# Altium schematic sheet CAN_Transceiver.SchDoc
size A4
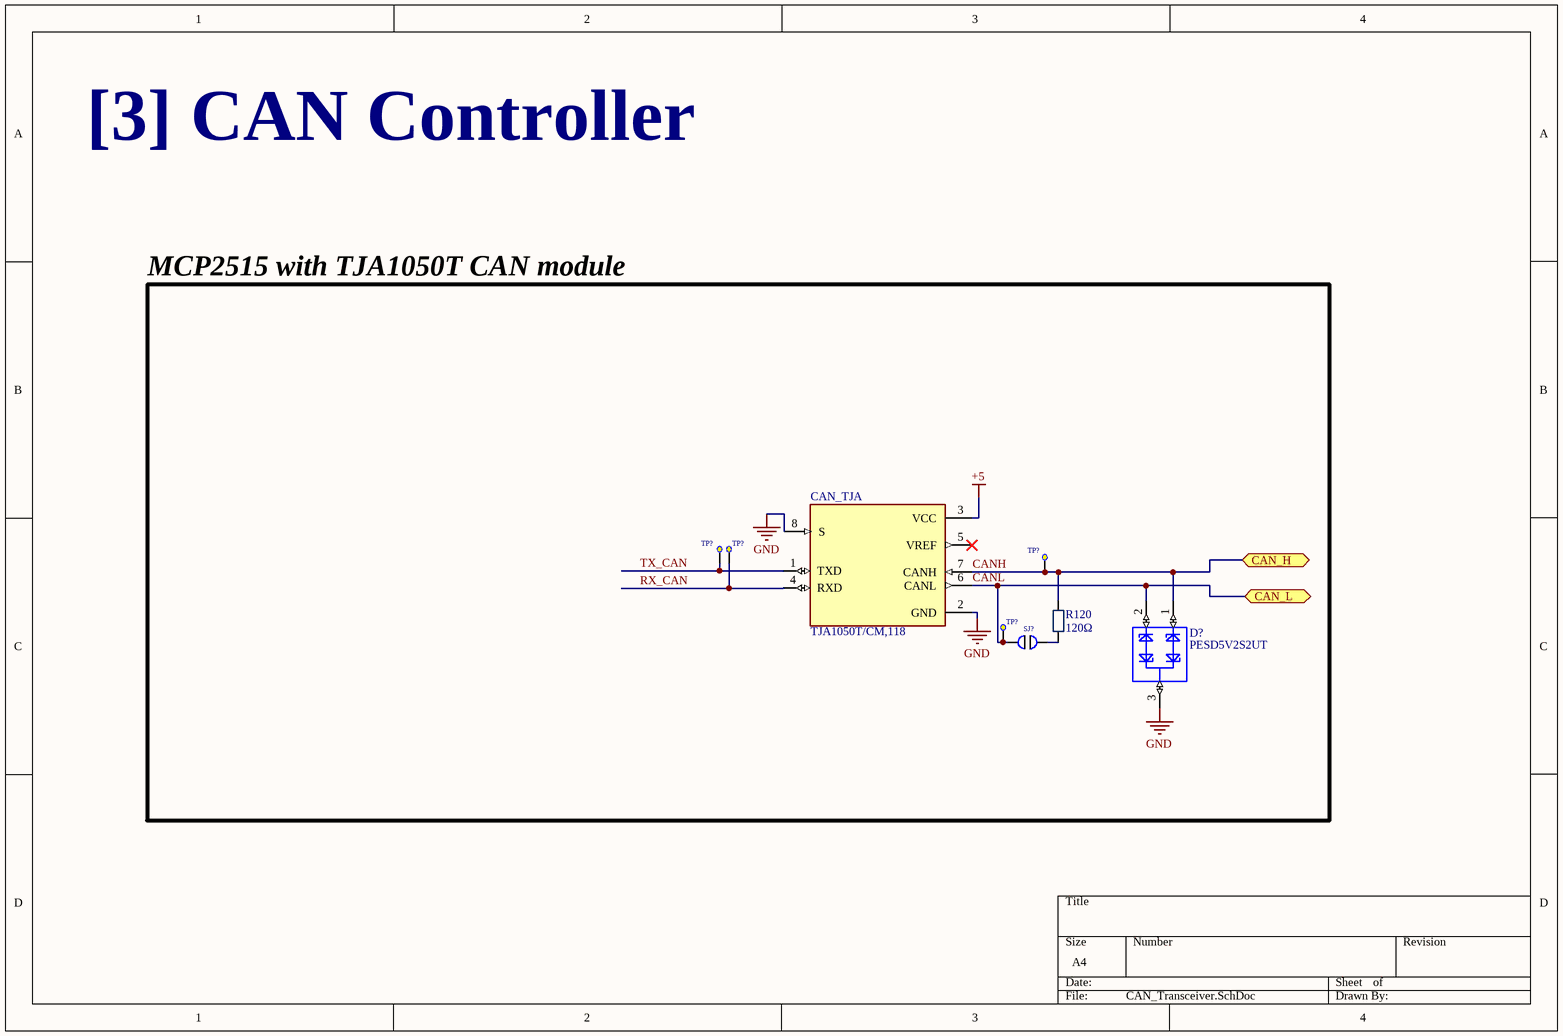
[diagram p0: CAN_Transceiver.SchDoc]

## Parts
(Parts that share a designator on the sheet are numbered #1, #2 ... from top to bottom, then left to right.)
CAN_TJA  TJA1050T/CM,118  [TJA1050T]
D?  PESD5V2S2UT  [PEDS1CAN]
R120  120Ω  [Resistor_0805_Generic]
SJ?  (no value)  [SolderJumpBridge]  (no BOM)
TP?#1  (no value)  [TestPoint]  (no BOM)
TP?#2  (no value)  [TestPoint]  (no BOM)
TP?#3  (no value)  [TestPoint]  (no BOM)
TP?#4  (no value)  [TestPoint]  (no BOM)

## Blocks framed on the sheet
MCP2515 with TJA1050T CAN module: CAN_TJA D? R120 SJ? TP?#1-TP?#4

## Ports
CAN_H (bidir), CAN_L (bidir)

## Nets
+5: CAN_TJA.3(VCC)
GND: CAN_TJA.2(GND) CAN_TJA.8(S) D?.3
CANH: CAN_TJA.7(CANH) D?.1 R120.2 TP?#3.1(Test_Point) ; port CAN_H
CANL: CAN_TJA.6(CANL) D?.2 SJ?.1 TP?#4.1(Test_Point) ; port CAN_L
RX_CAN: CAN_TJA.4(RXD) TP?#2.1(Test_Point)
TX_CAN: CAN_TJA.1(TXD) TP?#1.1(Test_Point)
NetR120_1: R120.1 SJ?.2

Not connected (* = marked no-connect by the designer): CAN_TJA 5(VREF)*

## Notes on the sheet
- [3] CAN Controller

## Library data of the parts
CAN_TJA = TJA1050T/CM,118: 1/1 Transceiver Half CANbus 8-SO; MF: NXP USA; SnapEDA_Link: https://www.snapeda.com/parts/TJA1050T/CM,118/NXP%20USA%20Inc./view-part/304529/?ref=snap; Value: *; Purchase-URL: https://pricing.snapeda.com/search/part/TJA1050T/CM,118/?ref=eda; Check_prices: https://www.snapeda.com/parts/TJA1050T/CM,118/NXP%20USA%20Inc./view-part/304529/?ref=eda; Price: None; Availability: In Stock; MP: TJA1050T/CM,118; Package: SO-8 NXP Semiconductors
D? = PESDCAN: ESD Protection Diodes / TVS Diodes PESD5V2S2UT/SOT23/TO-236AB; MF: Nexperia USA; MP: PESD1CAN; Availability: Unavailable; SnapEDA_Link: https://www.snapeda.com/parts/PESD1CAN/Nexperia%20USA%20Inc./view-part/2164340/?ref=snap; Price: None; Package: SOT-323 Nexperia USA; Value: *
R120 = Resistor_0805: 120Ω +-0.5%; 400V; 0805
SJ? = SolderJumpBridge
TP?#1-TP?#4 = TestPoint